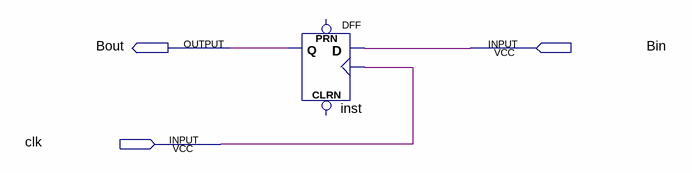
[diagram p0: schematic sheet]
// Quartus schematic setB.bdf as structural Verilog: 1 symbols, 3 pins
module setB (
  input  Bin,
  input  clk,
  output Bout
);

  DFF inst (.CLK(clk), .D(Bin), .Q(Bout));  // open: CLRN, PRN
endmodule
